# EAGLE schematic xmachine (EAGLE 9.6.1)

## Sheet 1 of 3
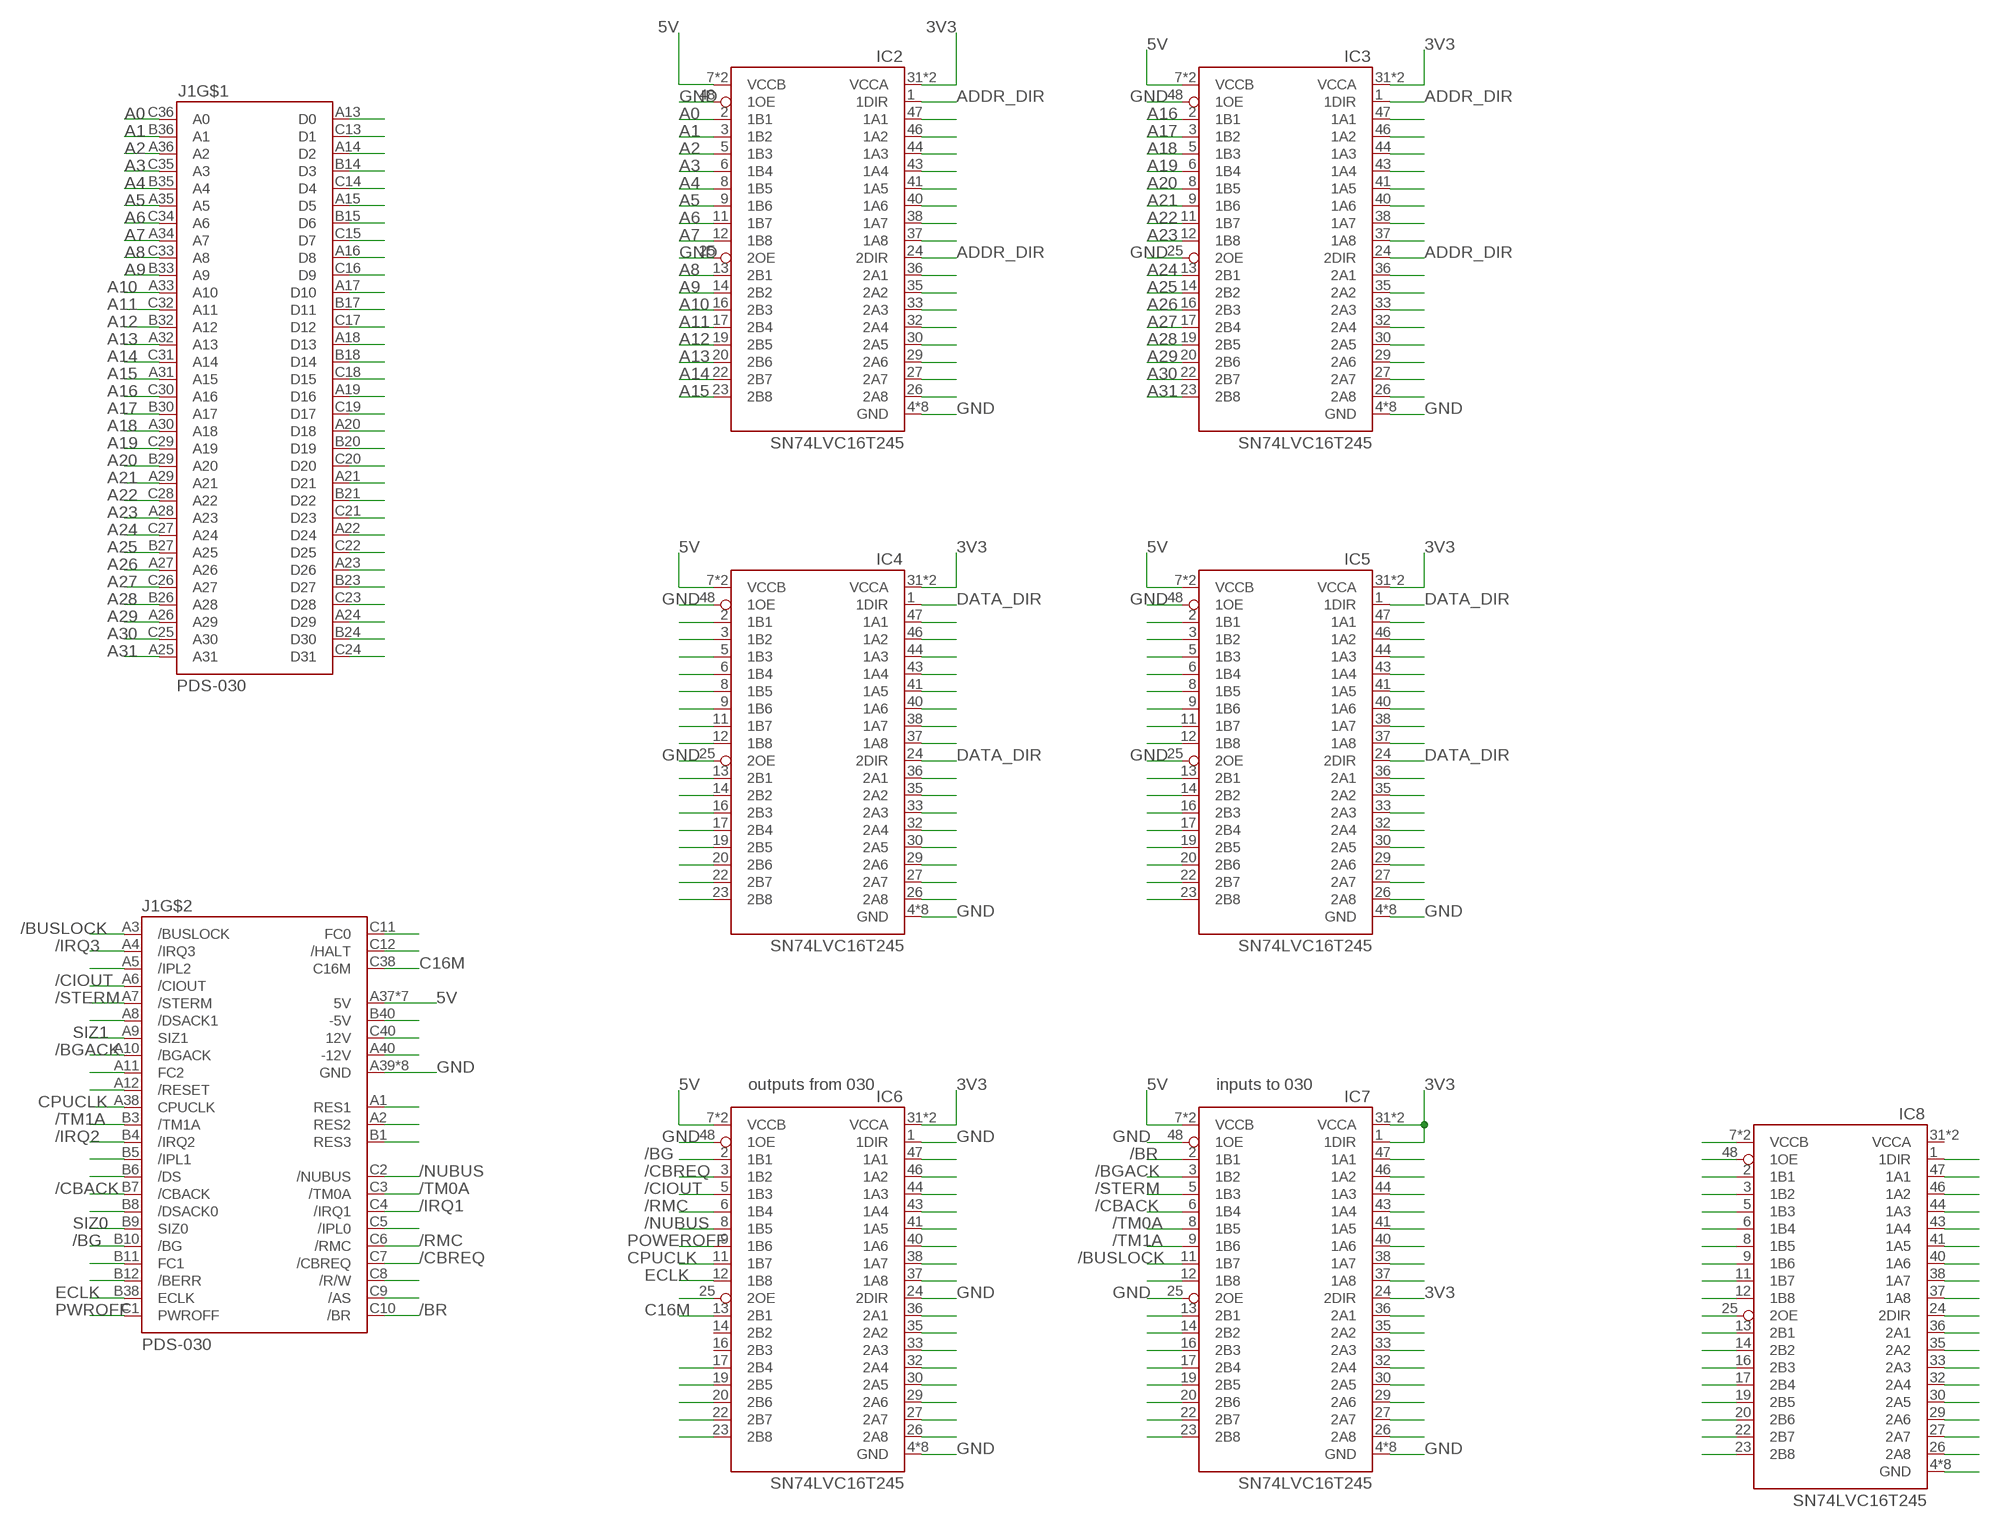
[diagram p0: schematic, sheet 1]

### Parts
IC2  SN74LVC16T245  [SOP63P1035X279-48N]
IC3  SN74LVC16T245  [SOP63P1035X279-48N]
IC4  SN74LVC16T245  [SOP63P1035X279-48N]
IC5  SN74LVC16T245  [SOP63P1035X279-48N]
IC6  SN74LVC16T245  [SOP63P1035X279-48N]
IC7  SN74LVC16T245  [SOP63P1035X279-48N]
IC8  SN74LVC16T245  [SOP63P1035X279-48N]
J1  PDS-030  [650906-5]

### Nets
3V3: IC2.31(VCCA) IC2.42(VCCA) IC3.31(VCCA) IC3.42(VCCA) IC4.31(VCCA) IC4.42(VCCA) IC5.31(VCCA) IC5.42(VCCA) IC6.31(VCCA) IC6.42(VCCA) IC7.1(1DIR) IC7.24(2DIR) IC7.31(VCCA) IC7.42(VCCA) ; also sheet 3
5V: IC2.7(VCCB) IC2.18(VCCB) IC3.7(VCCB) IC3.18(VCCB) IC4.7(VCCB) IC4.18(VCCB) IC5.7(VCCB) IC5.18(VCCB) IC6.7(VCCB) IC6.18(VCCB) IC7.7(VCCB) IC7.18(VCCB) J1.A37(5V) J1.B13(5V) J1.B19(5V) J1.B25(5V) J1.B31(5V) J1.B37(5V) J1.C37(5V)
/BG: IC6.2(1B1) J1.B10(/BG)
/BGACK: IC7.3(1B2) J1.A10(/BGACK)
/BR: IC7.2(1B1) J1.C10(/BR)
/BUSLOCK: IC7.11(1B7) J1.A3(/BUSLOCK)
/CBACK: IC7.6(1B4) J1.B7(/CBACK)
/CBREQ: IC6.3(1B2) J1.C7(/CBREQ)
/CIOUT: IC6.5(1B3) J1.A6(/CIOUT)
/IRQ1: J1.C4(/IRQ1)
/IRQ2: J1.B4(/IRQ2)
/IRQ3: J1.A4(/IRQ3)
/NUBUS: IC6.8(1B5) J1.C2(/NUBUS)
/RMC: IC6.6(1B4) J1.C6(/RMC)
/STERM: IC7.5(1B3) J1.A7(/STERM)
/TM0A: IC7.8(1B5) J1.C3(/TM0A)
/TM1A: IC7.9(1B6) J1.B3(/TM1A)
A0: IC2.2(1B1) J1.C36(A0)
A1: IC2.3(1B2) J1.B36(A1)
A2: IC2.5(1B3) J1.A36(A2)
A3: IC2.6(1B4) J1.C35(A3)
A4: IC2.8(1B5) J1.B35(A4)
A5: IC2.9(1B6) J1.A35(A5)
A6: IC2.11(1B7) J1.C34(A6)
A7: IC2.12(1B8) J1.A34(A7)
A8: IC2.13(2B1) J1.C33(A8)
A9: IC2.14(2B2) J1.B33(A9)
A10: IC2.16(2B3) J1.A33(A10)
A11: IC2.17(2B4) J1.C32(A11)
A12: IC2.19(2B5) J1.B32(A12)
A13: IC2.20(2B6) J1.A32(A13)
A14: IC2.22(2B7) J1.C31(A14)
A15: IC2.23(2B8) J1.A31(A15)
A16: IC3.2(1B1) J1.C30(A16)
A17: IC3.3(1B2) J1.B30(A17)
A18: IC3.5(1B3) J1.A30(A18)
A19: IC3.6(1B4) J1.C29(A19)
A20: IC3.8(1B5) J1.B29(A20)
A21: IC3.9(1B6) J1.A29(A21)
A22: IC3.11(1B7) J1.C28(A22)
A23: IC3.12(1B8) J1.A28(A23)
A24: IC3.13(2B1) J1.C27(A24)
A25: IC3.14(2B2) J1.B27(A25)
A26: IC3.16(2B3) J1.A27(A26)
A27: IC3.17(2B4) J1.C26(A27)
A28: IC3.19(2B5) J1.B26(A28)
A29: IC3.20(2B6) J1.A26(A29)
A30: IC3.22(2B7) J1.C25(A30)
A31: IC3.23(2B8) J1.A25(A31)
ADDR_DIR: IC2.1(1DIR) IC2.24(2DIR) IC3.1(1DIR) IC3.24(2DIR)
C16M: IC6.13(2B1) J1.C38(C16M)
CPUCLK: IC6.11(1B7) J1.A38(CPUCLK)
DATA_DIR: IC4.1(1DIR) IC4.24(2DIR) IC5.1(1DIR) IC5.24(2DIR)
ECLK: IC6.12(1B8) J1.B38(ECLK)
GND: IC2.4(GND) IC2.10(GND) IC2.15(GND) IC2.21(GND) IC2.25(2OE) IC2.28(GND) IC2.34(GND) IC2.39(GND) IC2.45(GND) IC2.48(1OE) IC3.4(GND) IC3.10(GND) IC3.15(GND) IC3.21(GND) IC3.25(2OE) IC3.28(GND) IC3.34(GND) IC3.39(GND) IC3.45(GND) IC3.48(1OE) IC4.4(GND) IC4.10(GND) IC4.15(GND) IC4.21(GND) IC4.25(2OE) IC4.28(GND) IC4.34(GND) IC4.39(GND) IC4.45(GND) IC4.48(1OE) IC5.4(GND) IC5.10(GND) IC5.15(GND) IC5.21(GND) IC5.25(2OE) IC5.28(GND) IC5.34(GND) IC5.39(GND) IC5.45(GND) IC5.48(1OE) IC6.1(1DIR) IC6.4(GND) IC6.10(GND) IC6.15(GND) IC6.21(GND) IC6.24(2DIR) IC6.28(GND) IC6.34(GND) IC6.39(GND) IC6.45(GND) IC6.48(1OE) IC7.4(GND) IC7.10(GND) IC7.15(GND) IC7.21(GND) IC7.25(2OE) IC7.28(GND) IC7.34(GND) IC7.39(GND) IC7.45(GND) IC7.48(1OE) J1.A39(GND) J1.B2(GND) J1.B16(GND) J1.B22(GND) J1.B28(GND) J1.B34(GND) J1.B39(GND) J1.C39(GND) ; also sheet 3
N$4: IC6.17(2B4)
N$5: IC6.19(2B5)
N$6: IC6.20(2B6)
N$7: IC6.22(2B7)
N$8: IC6.23(2B8)
N$35: J1.A5(/IPL2)
N$38: J1.A8(/DSACK1)
N$40: J1.A13(D0)
N$41: J1.C13(D1)
N$42: J1.A14(D2)
N$43: J1.B14(D3)
N$44: J1.C14(D4)
N$45: J1.A15(D5)
N$46: J1.B15(D6)
N$47: J1.C15(D7)
N$48: J1.A16(D8)
N$49: J1.C16(D9)
N$50: J1.A17(D10)
N$51: J1.B17(D11)
N$52: J1.C17(D12)
N$53: J1.A18(D13)
N$54: J1.B18(D14)
N$55: J1.C18(D15)
N$56: J1.A19(D16)
N$57: J1.C19(D17)
N$58: J1.A20(D18)
N$59: J1.B20(D19)
N$60: J1.C20(D20)
N$61: J1.A21(D21)
N$62: J1.B21(D22)
N$63: J1.C21(D23)
N$64: J1.A22(D24)
N$65: J1.C22(D25)
N$66: J1.A23(D26)
N$67: J1.B23(D27)
N$68: J1.C23(D28)
N$69: J1.A24(D29)
N$70: J1.B24(D30)
N$71: J1.C24(D31)
N$73: J1.A11(FC2)
N$74: J1.A12(/RESET)
N$78: J1.B5(/IPL1)
N$79: J1.B6(/DS)
N$81: J1.B8(/DSACK0)
N$84: J1.B11(FC1)
N$85: J1.B12(/BERR)
N$89: IC2.47(1A1)
N$90: IC2.46(1A2)
N$91: J1.C11(FC0)
N$92: J1.C12(/HALT)
N$94: IC2.44(1A3)
N$96: J1.B40(-5V)
N$97: J1.C40(12V)
N$98: J1.A40(-12V)
N$100: IC2.43(1A4)
N$101: J1.A1(RES1)
N$102: J1.A2(RES2)
N$103: J1.B1(RES3)
N$107: J1.C5(/IPL0)
N$110: J1.C8(/R/W)
N$111: J1.C9(/AS)
N$113: IC2.41(1A5)
N$114: IC2.40(1A6)
N$115: IC2.38(1A7)
N$116: IC2.37(1A8)
N$118: IC2.36(2A1)
N$119: IC2.35(2A2)
N$120: IC2.33(2A3)
N$122: IC2.32(2A4)
N$123: IC2.30(2A5)
N$124: IC2.29(2A6)
N$125: IC2.27(2A7)
N$126: IC2.26(2A8)
N$150: IC3.47(1A1)
N$151: IC3.46(1A2)
N$152: IC3.44(1A3)
N$153: IC3.43(1A4)
N$154: IC3.41(1A5)
N$155: IC3.40(1A6)
N$156: IC3.38(1A7)
N$157: IC3.37(1A8)
N$159: IC3.36(2A1)
N$160: IC3.35(2A2)
N$162: IC3.33(2A3)
N$163: IC3.32(2A4)
N$164: IC3.30(2A5)
N$165: IC3.29(2A6)
N$166: IC3.27(2A7)
N$167: IC3.26(2A8)
N$190: IC5.2(1B1)
N$191: IC5.3(1B2)
N$192: IC5.5(1B3)
N$193: IC5.6(1B4)
N$194: IC5.8(1B5)
N$195: IC5.9(1B6)
N$196: IC5.11(1B7)
N$197: IC5.12(1B8)
N$199: IC5.13(2B1)
N$200: IC5.14(2B2)
N$202: IC5.16(2B3)
N$203: IC5.17(2B4)
N$204: IC5.19(2B5)
N$205: IC5.20(2B6)
N$206: IC5.22(2B7)
N$207: IC5.23(2B8)
N$209: IC5.47(1A1)
N$210: IC5.46(1A2)
N$211: IC5.44(1A3)
N$212: IC5.43(1A4)
N$213: IC5.41(1A5)
N$214: IC5.40(1A6)
N$215: IC5.38(1A7)
N$216: IC5.37(1A8)
N$218: IC5.36(2A1)
N$219: IC5.35(2A2)
N$220: IC5.33(2A3)
N$222: IC5.32(2A4)
N$223: IC5.30(2A5)
N$224: IC5.29(2A6)
N$225: IC5.27(2A7)
N$226: IC5.26(2A8)
N$229: IC4.47(1A1)
N$230: IC4.46(1A2)
N$231: IC4.44(1A3)
N$232: IC4.43(1A4)
N$233: IC4.41(1A5)
N$234: IC4.40(1A6)
N$235: IC4.38(1A7)
N$236: IC4.37(1A8)
N$238: IC4.36(2A1)
N$239: IC4.35(2A2)
N$240: IC4.33(2A3)
N$242: IC4.32(2A4)
N$243: IC4.30(2A5)
N$244: IC4.29(2A6)
N$245: IC4.27(2A7)
N$246: IC4.26(2A8)
N$250: IC4.2(1B1)
N$251: IC4.3(1B2)
N$252: IC4.5(1B3)
N$253: IC4.6(1B4)
N$254: IC4.8(1B5)
N$255: IC4.9(1B6)
N$256: IC4.11(1B7)
N$257: IC4.12(1B8)
N$259: IC4.13(2B1)
N$260: IC4.14(2B2)
N$262: IC4.16(2B3)
N$263: IC4.17(2B4)
N$264: IC4.19(2B5)
N$265: IC4.20(2B6)
N$266: IC4.22(2B7)
N$267: IC4.23(2B8)
N$270: IC6.47(1A1)
N$271: IC6.46(1A2)
N$272: IC6.44(1A3)
N$273: IC6.43(1A4)
N$274: IC6.41(1A5)
N$275: IC6.40(1A6)
N$276: IC6.38(1A7)
N$277: IC6.37(1A8)
N$279: IC6.36(2A1)
N$280: IC6.35(2A2)
N$282: IC6.33(2A3)
N$283: IC6.32(2A4)
N$284: IC6.30(2A5)
N$285: IC6.29(2A6)
N$286: IC6.27(2A7)
N$287: IC6.26(2A8)
N$298: IC6.25(2OE)
N$307: IC7.12(1B8)
N$309: IC7.47(1A1)
N$310: IC7.46(1A2)
N$311: IC7.44(1A3)
N$312: IC7.43(1A4)
N$313: IC7.41(1A5)
N$314: IC7.40(1A6)
N$315: IC7.38(1A7)
N$316: IC7.37(1A8)
N$318: IC7.36(2A1)
N$319: IC7.35(2A2)
N$320: IC7.33(2A3)
N$322: IC7.32(2A4)
N$323: IC7.30(2A5)
N$324: IC7.29(2A6)
N$325: IC7.27(2A7)
N$326: IC7.26(2A8)
N$339: IC7.13(2B1)
N$340: IC7.14(2B2)
N$342: IC7.16(2B3)
N$343: IC7.17(2B4)
N$344: IC7.19(2B5)
N$345: IC7.20(2B6)
N$346: IC7.22(2B7)
N$347: IC7.23(2B8)
N$348: IC8.1(1DIR)
N$349: IC8.47(1A1)
N$350: IC8.46(1A2)
N$351: IC8.44(1A3)
N$352: IC8.43(1A4)
N$353: IC8.41(1A5)
N$354: IC8.40(1A6)
N$355: IC8.38(1A7)
N$356: IC8.37(1A8)
N$357: IC8.24(2DIR)
N$358: IC8.36(2A1)
N$359: IC8.35(2A2)
N$360: IC8.33(2A3)
N$362: IC8.32(2A4)
N$363: IC8.30(2A5)
N$364: IC8.29(2A6)
N$365: IC8.27(2A7)
N$366: IC8.26(2A8)
N$367: IC8.4(GND) IC8.10(GND) IC8.15(GND) IC8.21(GND) IC8.28(GND) IC8.34(GND) IC8.39(GND) IC8.45(GND)
N$368: IC8.7(VCCB) IC8.18(VCCB)
N$369: IC8.48(1OE)
N$370: IC8.2(1B1)
N$371: IC8.3(1B2)
N$372: IC8.5(1B3)
N$373: IC8.6(1B4)
N$374: IC8.8(1B5)
N$375: IC8.9(1B6)
N$376: IC8.11(1B7)
N$377: IC8.12(1B8)
N$378: IC8.25(2OE)
N$379: IC8.13(2B1)
N$380: IC8.14(2B2)
N$382: IC8.16(2B3)
N$383: IC8.17(2B4)
N$384: IC8.19(2B5)
N$385: IC8.20(2B6)
N$386: IC8.22(2B7)
N$387: IC8.23(2B8)
POWEROFF: IC6.9(1B6)
PWROFF: J1.C1(PWROFF)
SIZ0: J1.B9(SIZ0)
SIZ1: J1.A9(SIZ1)
Unconnected: IC6.14(2B2) IC6.16(2B3) IC8.31(VCCA) IC8.42(VCCA)

### Notes on the sheet
- outputs from 030 | inputs to 030

## Sheet 2 of 3
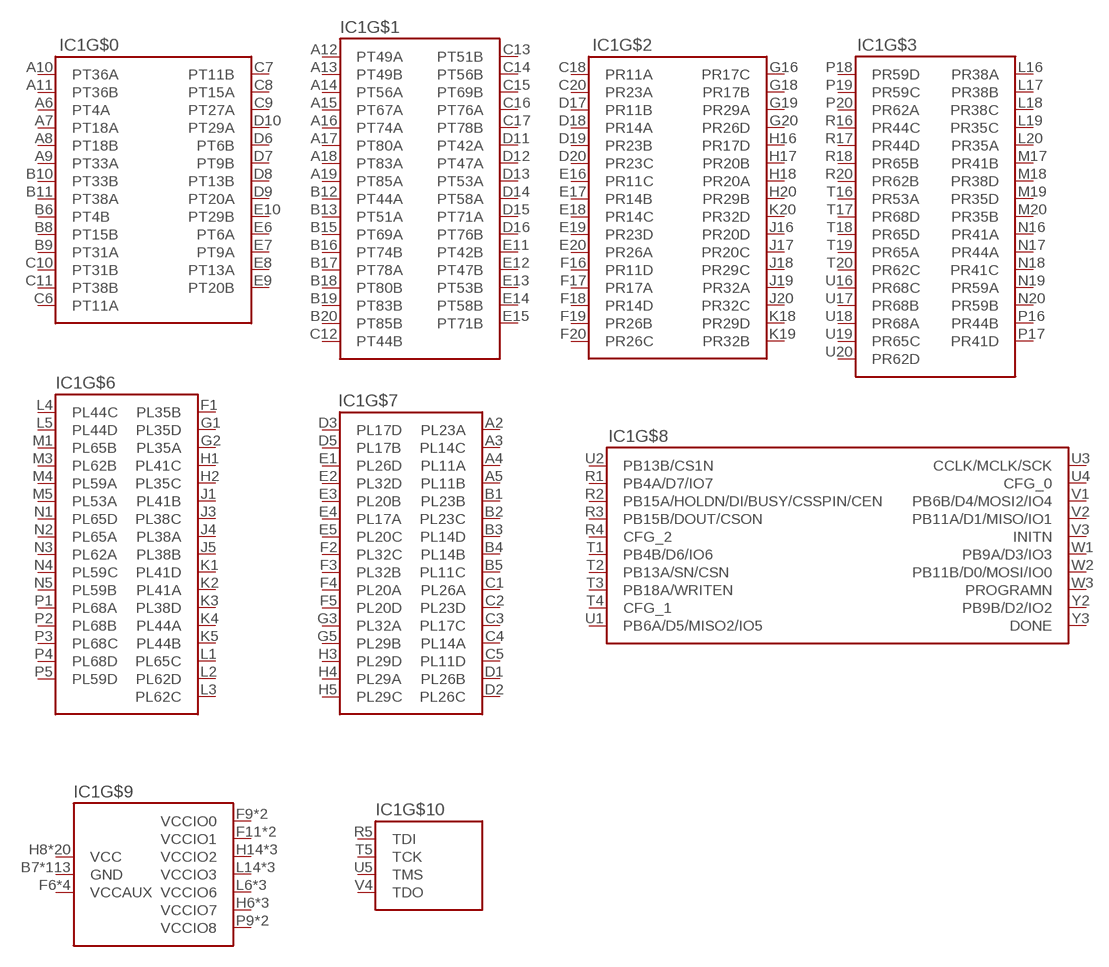
[diagram p1: schematic, sheet 2]

### Parts
IC1  ECP5-LFE5U-XXF-8BG381C  [BGA400C80P20X20_1700X1700X176N]
Unconnected: IC1.A2(PL23A) IC1.A3(PL14C) IC1.A4(PL11A) IC1.A5(PL11B) IC1.A6(PT4A) IC1.A7(PT18A) IC1.A8(PT18B) IC1.A9(PT33A) IC1.A10(PT36A) IC1.A11(PT36B) IC1.A12(PT49A) IC1.A13(PT49B) IC1.A14(PT56A) IC1.A15(PT67A) IC1.A16(PT74A) IC1.A17(PT80A) IC1.A18(PT83A) IC1.A19(PT85A) IC1.B1(PL23B) IC1.B2(PL23C) IC1.B3(PL14D) IC1.B4(PL14B) IC1.B5(PL11C) IC1.B6(PT4B) IC1.B7(GND) IC1.B8(PT15B) IC1.B9(PT31A) IC1.B10(PT33B) IC1.B11(PT38A) IC1.B12(PT44A) IC1.B13(PT51A) IC1.B14(GND) IC1.B15(PT69A) IC1.B16(PT74B) IC1.B17(PT78A) IC1.B18(PT80B) IC1.B19(PT83B) IC1.B20(PT85B) IC1.C1(PL26A) IC1.C2(PL23D) IC1.C3(PL17C) IC1.C4(PL14A) IC1.C5(PL11D) IC1.C6(PT11A) IC1.C7(PT11B) IC1.C8(PT15A) IC1.C9(PT27A) IC1.C10(PT31B) IC1.C11(PT38B) IC1.C12(PT44B) IC1.C13(PT51B) IC1.C14(PT56B) IC1.C15(PT69B) IC1.C16(PT76A) IC1.C17(PT78B) IC1.C18(PR11A) IC1.C19(GND) IC1.C20(PR23A) IC1.D1(PL26B) IC1.D2(PL26C) IC1.D3(PL17D) IC1.D4(GND) IC1.D5(PL17B) IC1.D6(PT6B) IC1.D7(PT9B) IC1.D8(PT13B) IC1.D9(PT20A) IC1.D10(PT29A) IC1.D11(PT42A) IC1.D12(PT47A) IC1.D13(PT53A) IC1.D14(PT58A) IC1.D15(PT71A) IC1.D16(PT76B) IC1.D17(PR11B) IC1.D18(PR14A) IC1.D19(PR23B) IC1.D20(PR23C) IC1.E1(PL26D) IC1.E2(PL32D) IC1.E3(PL20B) IC1.E4(PL17A) IC1.E5(PL20C) IC1.E6(PT6A) IC1.E7(PT9A) IC1.E8(PT13A) IC1.E9(PT20B) IC1.E10(PT29B) IC1.E11(PT42B) IC1.E12(PT47B) IC1.E13(PT53B) IC1.E14(PT58B) IC1.E15(PT71B) IC1.E16(PR11C) IC1.E17(PR14B) IC1.E18(PR14C) IC1.E19(PR23D) IC1.E20(PR26A) IC1.F1(PL35B) IC1.F2(PL32C) IC1.F3(PL32B) IC1.F4(PL20A) IC1.F5(PL20D) IC1.F6(VCCAUX) IC1.F7(GND) IC1.F8(GND) IC1.F9(VCCIO0) IC1.F10(VCCIO0) IC1.F11(VCCIO1) IC1.F12(VCCIO1) IC1.F13(GND) IC1.F14(GND) IC1.F15(VCCAUX) IC1.F16(PR11D) IC1.F17(PR17A) IC1.F18(PR14D) IC1.F19(PR26B) IC1.F20(PR26C) IC1.G1(PL35D) IC1.G2(PL35A) IC1.G3(PL32A) IC1.G4(GND) IC1.G5(PL29B) IC1.G6(GND) IC1.G7(GND) IC1.G8(GND) IC1.G9(GND) IC1.G10(GND) IC1.G11(GND) IC1.G12(GND) IC1.G13(GND) IC1.G14(GND) IC1.G15(GND) IC1.G16(PR17C) IC1.G17(GND) IC1.G18(PR17B) IC1.G19(PR29A) IC1.G20(PR26D) IC1.H1(PL41C) IC1.H2(PL35C) IC1.H3(PL29D) IC1.H4(PL29A) IC1.H5(PL29C) IC1.H6(VCCIO7) IC1.H7(VCCIO7) IC1.H8(VCC) IC1.H9(VCC) IC1.H10(VCC) IC1.H11(VCC) IC1.H12(VCC) IC1.H13(VCC) IC1.H14(VCCIO2) IC1.H15(VCCIO2) IC1.H16(PR17D) IC1.H17(PR20B) IC1.H18(PR20A) IC1.H19(GND) IC1.H20(PR29B) IC1.J1(PL41B) IC1.J2(GND) IC1.J3(PL38C) IC1.J4(PL38A) IC1.J5(PL38B) IC1.J6(VCCIO7) IC1.J7(GND) IC1.J8(VCC) IC1.J9(GND) IC1.J10(GND) IC1.J11(GND) IC1.J12(GND) IC1.J13(VCC) IC1.J14(GND) IC1.J15(VCCIO2) IC1.J16(PR20D) IC1.J17(PR20C) IC1.J18(PR29C) IC1.J19(PR32A) IC1.J20(PR32C) IC1.K1(PL41D) IC1.K2(PL41A) IC1.K3(PL38D) IC1.K4(PL44A) IC1.K5(PL44B) IC1.K6(GND) IC1.K7(GND) IC1.K8(VCC) IC1.K9(GND) IC1.K10(GND) IC1.K11(GND) IC1.K12(GND) IC1.K13(VCC) IC1.K14(GND) IC1.K15(GND) IC1.K18(PR29D) IC1.K19(PR32B) IC1.K20(PR32D) IC1.L1(PL65C) IC1.L2(PL62D) IC1.L3(PL62C) IC1.L4(PL44C) IC1.L5(PL44D) IC1.L6(VCCIO6) IC1.L7(VCCIO6) IC1.L8(VCC) IC1.L9(GND) IC1.L10(GND) IC1.L11(GND) IC1.L12(GND) IC1.L13(VCC) IC1.L14(VCCIO3) IC1.L15(VCCIO3) IC1.L16(PR38A) IC1.L17(PR38B) IC1.L18(PR38C) IC1.L19(PR35C) IC1.L20(PR35A) IC1.M1(PL65B) IC1.M2(GND) IC1.M3(PL62B) IC1.M4(PL59A) IC1.M5(PL53A) IC1.M6(VCCIO6) IC1.M7(GND) IC1.M8(VCC) IC1.M9(GND) IC1.M10(GND) IC1.M11(GND) IC1.M12(GND) IC1.M13(VCC) IC1.M14(GND) IC1.M15(VCCIO3) IC1.M16(GND) IC1.M17(PR41B) IC1.M18(PR38D) IC1.M19(PR35D) IC1.M20(PR35B) IC1.N1(PL65D) IC1.N2(PL65A) IC1.N3(PL62A) IC1.N4(PL59C) IC1.N5(PL59B) IC1.N6(GND) IC1.N7(GND) IC1.N8(VCC) IC1.N9(VCC) IC1.N10(VCC) IC1.N11(VCC) IC1.N12(VCC) IC1.N13(VCC) IC1.N14(GND) IC1.N15(GND) IC1.N16(PR41A) IC1.N17(PR44A) IC1.N18(PR41C) IC1.N19(PR59A) IC1.N20(PR59B) IC1.P1(PL68A) IC1.P2(PL68B) IC1.P3(PL68C) IC1.P4(PL68D) IC1.P5(PL59D) IC1.P6(VCCAUX) IC1.P7(GND) IC1.P8(GND) IC1.P9(VCCIO8) IC1.P10(VCCIO8) IC1.P11(GND) IC1.P12(GND) IC1.P13(GND) IC1.P14(GND) IC1.P15(VCCAUX) IC1.P16(PR44B) IC1.P17(PR41D) IC1.P18(PR59D) IC1.P19(PR59C) IC1.P20(PR62A) IC1.R1(PB4A/D7/IO7) IC1.R2(PB15A/HOLDN/DI/BUSY/CSSPIN/CEN) IC1.R3(PB15B/DOUT/CSON) IC1.R4(CFG_2) IC1.R5(TDI) IC1.R16(PR44C) IC1.R17(PR44D) IC1.R18(PR65B) IC1.R19(GND) IC1.R20(PR62B) IC1.T1(PB4B/D6/IO6) IC1.T2(PB13A/SN/CSN) IC1.T3(PB18A/WRITEN) IC1.T4(CFG_1) IC1.T5(TCK) IC1.T6(GND) IC1.T7(GND) IC1.T8(GND) IC1.T9(GND) IC1.T10(GND) IC1.T11(GND) IC1.T12(GND) IC1.T13(GND) IC1.T14(GND) IC1.T15(GND) IC1.T16(PR53A) IC1.T17(PR68D) IC1.T18(PR65D) IC1.T19(PR65A) IC1.T20(PR62C) IC1.U1(PB6A/D5/MISO2/IO5) IC1.U2(PB13B/CS1N) IC1.U3(CCLK/MCLK/SCK) IC1.U4(CFG_0) IC1.U5(TMS) IC1.U6(GND) IC1.U7(GND) IC1.U8(GND) IC1.U9(GND) IC1.U10(GND) IC1.U11(GND) IC1.U12(GND) IC1.U13(GND) IC1.U14(GND) IC1.U15(GND) IC1.U16(PR68C) IC1.U17(PR68B) IC1.U18(PR68A) IC1.U19(PR65C) IC1.U20(PR62D) IC1.V1(PB6B/D4/MOSI2/IO4) IC1.V2(PB11A/D1/MISO/IO1) IC1.V3(INITN) IC1.V4(TDO) IC1.V5(GND) IC1.V6(GND) IC1.V7(GND) IC1.V8(GND) IC1.V9(GND) IC1.V10(GND) IC1.V11(GND) IC1.V12(GND) IC1.V13(GND) IC1.V14(GND) IC1.V15(GND) IC1.V16(GND) IC1.V17(GND) IC1.V18(GND) IC1.V19(GND) IC1.V20(GND) IC1.W1(PB9A/D3/IO3) IC1.W2(PB11B/D0/MOSI/IO0) IC1.W3(PROGRAMN) IC1.W6(GND) IC1.W7(GND) IC1.W12(GND) IC1.W15(GND) IC1.W16(GND) IC1.W19(GND) IC1.W20(GND) IC1.Y2(PB9B/D2/IO2) IC1.Y3(DONE) IC1.Y5(GND) IC1.Y6(GND) IC1.Y7(GND) IC1.Y8(GND) IC1.Y11(GND) IC1.Y12(GND) IC1.Y14(GND) IC1.Y15(GND) IC1.Y16(GND) IC1.Y17(GND) IC1.Y19(GND)

## Sheet 3 of 3
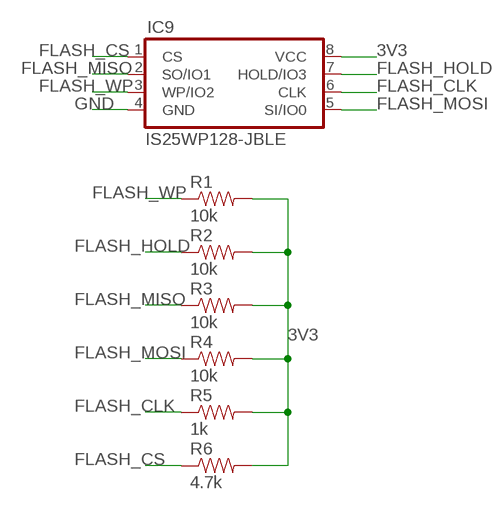
[diagram p2: schematic, sheet 3]

### Parts
IC9  IS25WP128-JBLE  W25Q64FWSSIG  [SOIC127P790X216-8N]
R1  10k  RESISTOR0402-RES  [R0402]
R2  10k  RESISTOR0402-RES  [R0402]
R3  10k  RESISTOR0402-RES  [R0402]
R4  10k  RESISTOR0402-RES  [R0402]
R5  1k  RESISTOR0402-RES  [R0402]
R6  4.7k  RESISTOR0402-RES  [R0402]

### Nets
3V3: IC9.8(VCC) R1.2 R2.2 R3.2 R4.2 R5.2 R6.2 ; also sheet 1
FLASH_CLK: IC9.6(CLK) R5.1
FLASH_CS: IC9.1(CS) R6.1
FLASH_HOLD: IC9.7(HOLD/IO3) R2.1
FLASH_MISO: IC9.2(SO/IO1) R3.1
FLASH_MOSI: IC9.5(SI/IO0) R4.1
FLASH_WP: IC9.3(WP/IO2) R1.1
GND: IC9.4(GND) ; also sheet 1

## Library data of the parts
IC1 = sk9k-Lattice:ECP5-LFE5U-XXF-8BG381C: Lattice ECP5 -- LFE5U-XXF-8BG381C IC FPGA 203 I/O 381CABGA; DK: 220-1992-ND; PARTNO: LFE5U-45F-8BG381C
IC2-IC8 = sk9k-Texas Instruments:SN74LVC16T245: SN74LVC16T245 - Voltage Level Translator Bidirectional 2 Circuit 8 Channel 48-TSSOP; DATASHEET: http://www.ti.com/lit/ds/symlink/sn74lvc16t245.pdf; DK: 296-20631-1-ND; PARTNO: SN74LVC16T245DGGR
IC9 = sk9k-Memory:W25Q64FWSSIG: FLASH - NOR Memory IC 64Mb (8M x 8) SPI 104MHz 8-SOIC 8-SOIC (0.209", 5.30mm Width); DATASHEET: http://www.issi.com/WW/pdf/IS25WP032-064-128.pdf; DK: 706-1443-ND; HEIGHT: 2.16; PARTNO: IS25WP128-JBLE
J1 = sk9k-TE:PDS-030: "Eurocard" 120 Position Din Connector Plug, Male Pins Gold Through Hole, Right Angle; DATASHEET: https://www.te.com/commerce/DocumentDelivery/DDEController?Action=srchrtrv&DocNm=650906&DocType=Customer+Drawing&DocLang=English; DK: A1277-ND; PARTNO: 650906-5
R1-R6 = sk9k-RCL:RESISTOR: Resistor Basic schematic elements and footprints for 0603, 1206, and PTH resistors.; HEIGHT: 0.3